# EAGLE design segment_display_2x_static (EAGLE 6.2)
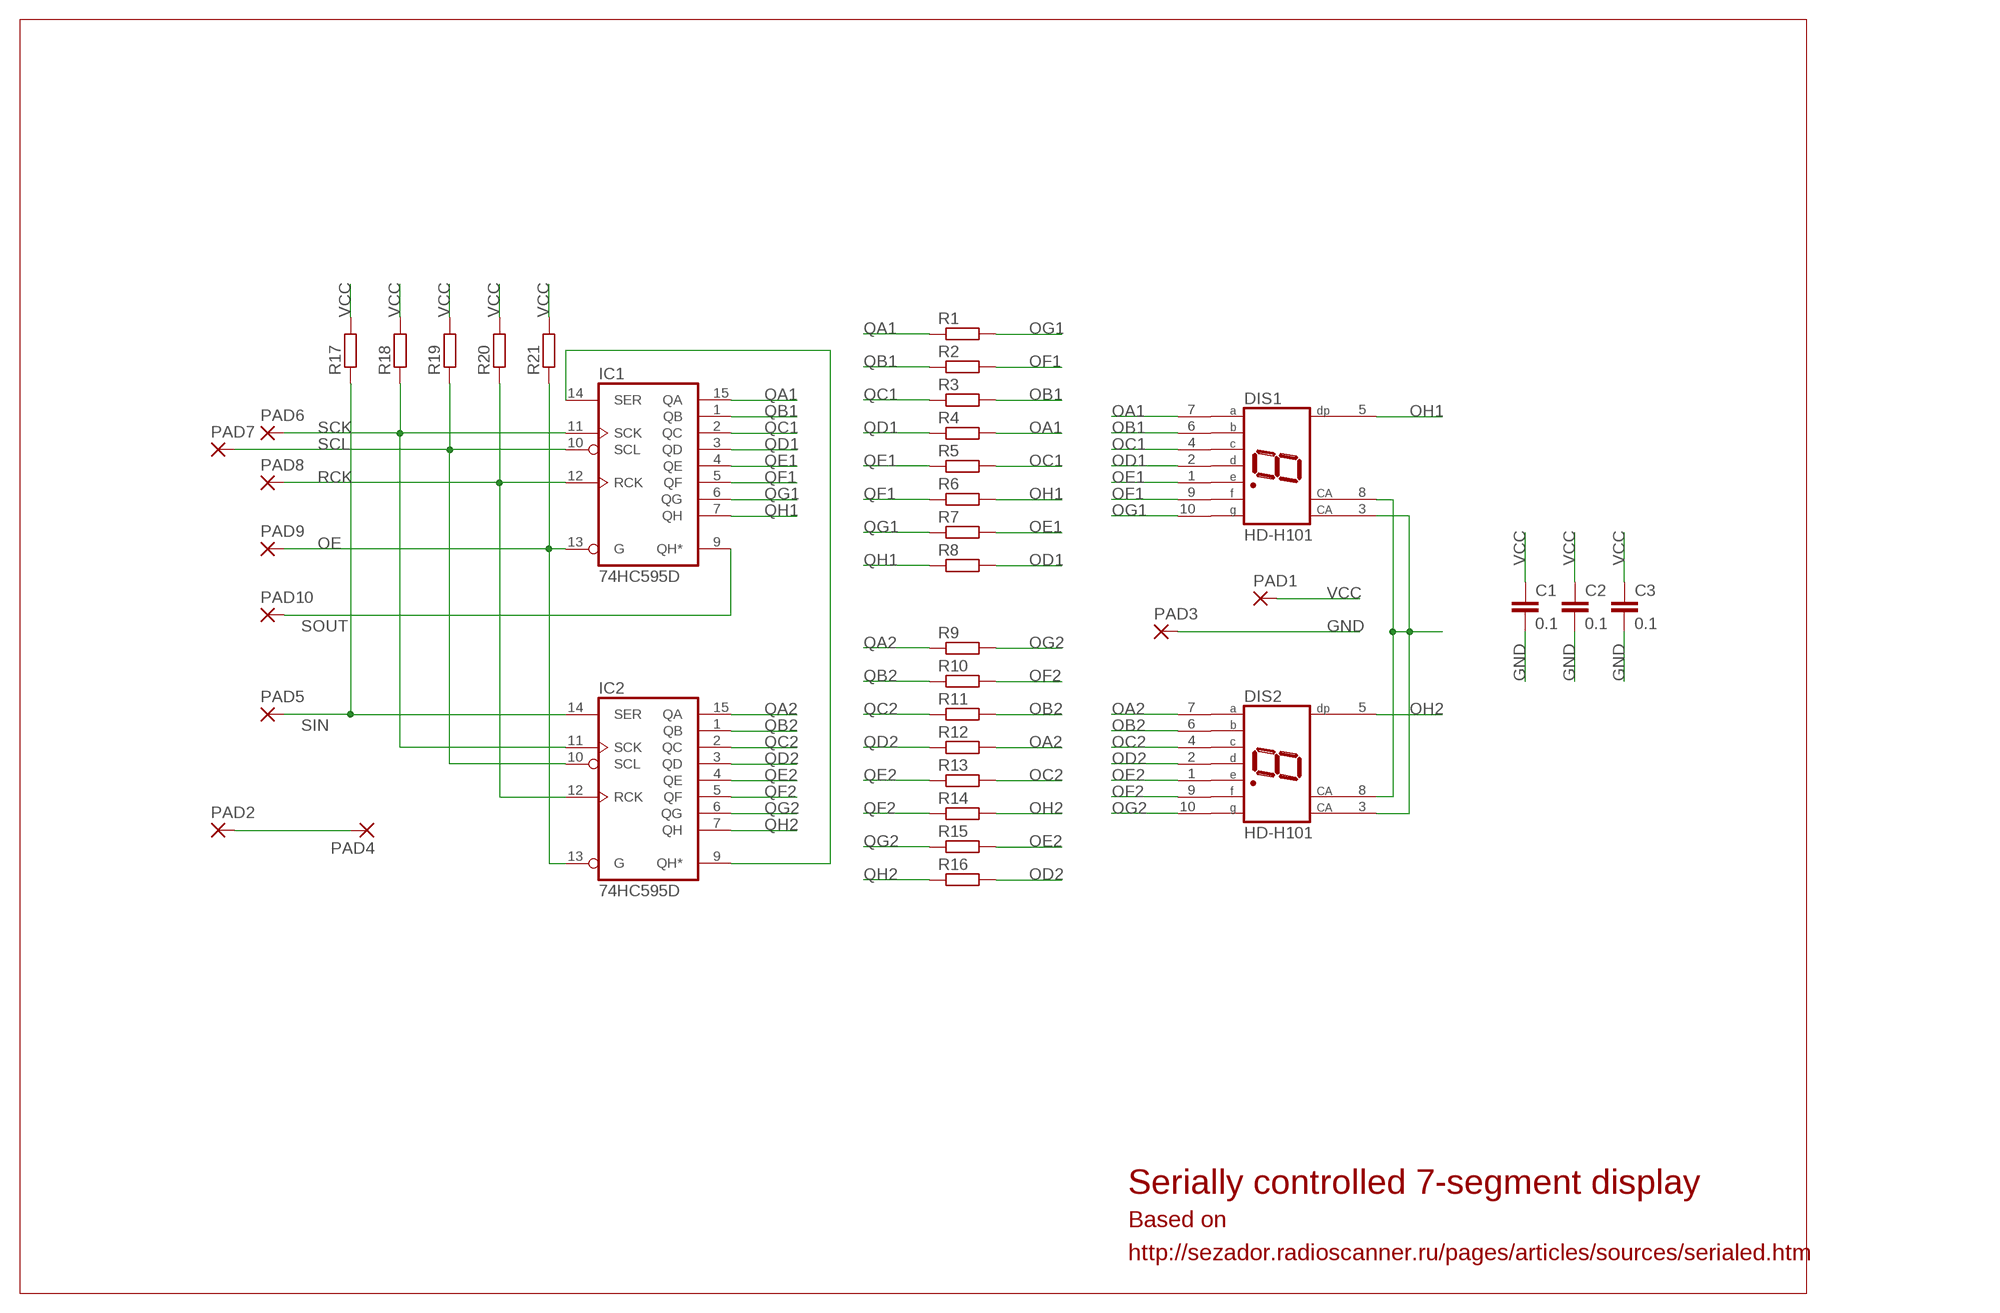
[diagram p0: schematic, sheet 1]

## Parts
C1  0.1  C-EUC0805  [C0805]
C2  0.1  C-EUC0805  [C0805]
C3  0.1  C-EUC0805  [C0805]
DIS1  HD-H101  [HDSP-M]
DIS2  HD-H101  [HDSP-M]
IC1  74HC595D  [SO16]
IC2  74HC595D  [SO16]
PAD1  1,6/0,8  [1,6/0,8]
PAD2  1,6/0,8  [1,6/0,8]
PAD3  1,6/0,8  [1,6/0,8]
PAD4  1,6/0,8  [1,6/0,8]
PAD5  1,6/0,8  [1,6/0,8]
PAD6  1,6/0,8  [1,6/0,8]
PAD7  1,6/0,8  [1,6/0,8]
PAD8  1,6/0,8  [1,6/0,8]
PAD9  1,6/0,8  [1,6/0,8]
PAD10  1,6/0,8  [1,6/0,8]
R1  R-EU_R0805  [R0805]
R2  R-EU_R0805  [R0805]
R3  R-EU_R0805  [R0805]
R4  R-EU_R0805  [R0805]
R5  R-EU_R0805  [R0805]
R6  R-EU_R0805  [R0805]
R7  R-EU_R0805  [R0805]
R8  R-EU_R0805  [R0805]
R9  R-EU_R0805  [R0805]
R10  R-EU_R0805  [R0805]
R11  R-EU_R0805  [R0805]
R12  R-EU_R0805  [R0805]
R13  R-EU_R0805  [R0805]
R14  R-EU_R0805  [R0805]
R15  R-EU_R0805  [R0805]
R16  R-EU_R0805  [R0805]
R17  R-EU_R0805  [R0805]
R18  R-EU_R0805  [R0805]
R19  R-EU_R0805  [R0805]
R20  R-EU_R0805  [R0805]
R21  R-EU_R0805  [R0805]

## Nets
GND: C1.2 C2.2 C3.2 PAD3.1(P)
LINK: IC1.14(SER) IC2.9(QH*)
OA1: DIS1.7(A) R4.2
OA2: DIS2.7(A) R12.2
OB1: DIS1.6(B) R3.2
OB2: DIS2.6(B) R11.2
OC1: DIS1.4(C) R5.2
OC2: DIS2.4(C) R13.2
OD1: DIS1.2(D) R8.2
OD2: DIS2.2(D) R16.2
OE: IC1.13(G) IC2.13(G) PAD9.1(P) R21.1
OE1: DIS1.1(E) R7.2
OE2: DIS2.1(E) R15.2
OF1: DIS1.9(F) R2.2
OF2: DIS2.9(F) R10.2
OG1: DIS1.10(G) R1.2
OG2: DIS2.10(G) R9.2
OH1: DIS1.5(DP) R6.2
OH2: DIS2.5(DP) R14.2
QA1: IC1.15(QA) R1.1
QA2: IC2.15(QA) R9.1
QB1: IC1.1(QB) R2.1
QB2: IC2.1(QB) R10.1
QC1: IC1.2(QC) R3.1
QC2: IC2.2(QC) R11.1
QD1: IC1.3(QD) R4.1
QD2: IC2.3(QD) R12.1
QE1: IC1.4(QE) R5.1
QE2: IC2.4(QE) R13.1
QF1: IC1.5(QF) R6.1
QF2: IC2.5(QF) R14.1
QG1: IC1.6(QG) R7.1
QG2: IC2.6(QG) R15.1
QH1: IC1.7(QH) R8.1
QH2: IC2.7(QH) R16.1
RCK: IC1.12(RCK) IC2.12(RCK) PAD8.1(P) R20.1
RET: PAD2.1(P) PAD4.1(P)
SCK: IC1.11(SCK) IC2.11(SCK) PAD6.1(P) R18.1
SCL: IC1.10(SCL) IC2.10(SCL) PAD7.1(P) R19.1
SIN: IC2.14(SER) PAD5.1(P) R17.1
SOUT: IC1.9(QH*) PAD10.1(P)
VCC: C1.1 C2.1 C3.1 DIS1.3(CA) DIS1.8(CA) DIS2.3(CA) DIS2.8(CA) PAD1.1(P) R17.2 R18.2 R19.2 R20.2 R21.2

## Notes on the sheet
- Serially controlled 7-segment display
- Based on
- http://sezador.radioscanner.ru/pages/articles/sources/serialed.htm

## Power pins joined to a net without a drawn wire
GND: IC1.8(GND) IC2.8(GND)
VCC: IC1.16(VCC) IC2.16(VCC)

## Library data of the parts
C1-C3 = rcl:C-EU: CAPACITOR, European symbol
DIS1 DIS2 = display-hp:HD-H101: LED DISPLAY 1-character 7 segment, decimal point right; OC_FARNELL: unknown; OC_NEWARK: unknown
IC1 IC2 = 74xx-eu:74*595: 8-bit SHIFT REGISTER, output latch
PAD1-PAD10 = wirepad:1,6/0,8: THROUGH-HOLE PAD
R1-R21 = rcl:R-EU_: RESISTOR, European symbol

## Board
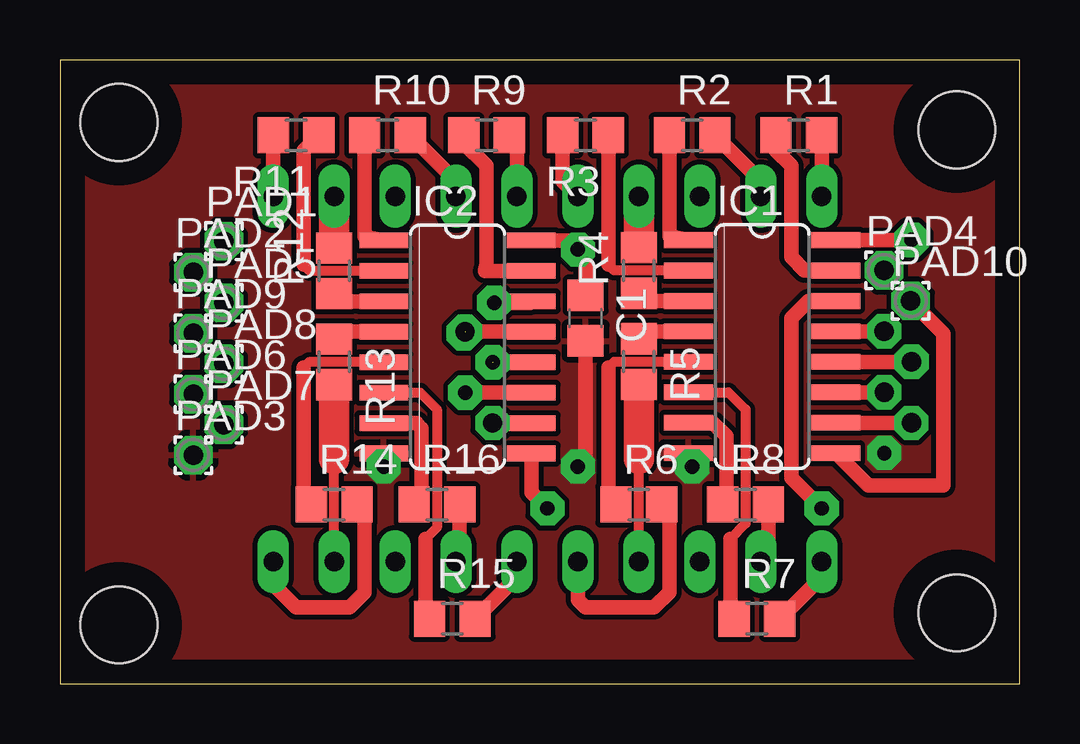
[diagram p1: board, top side]
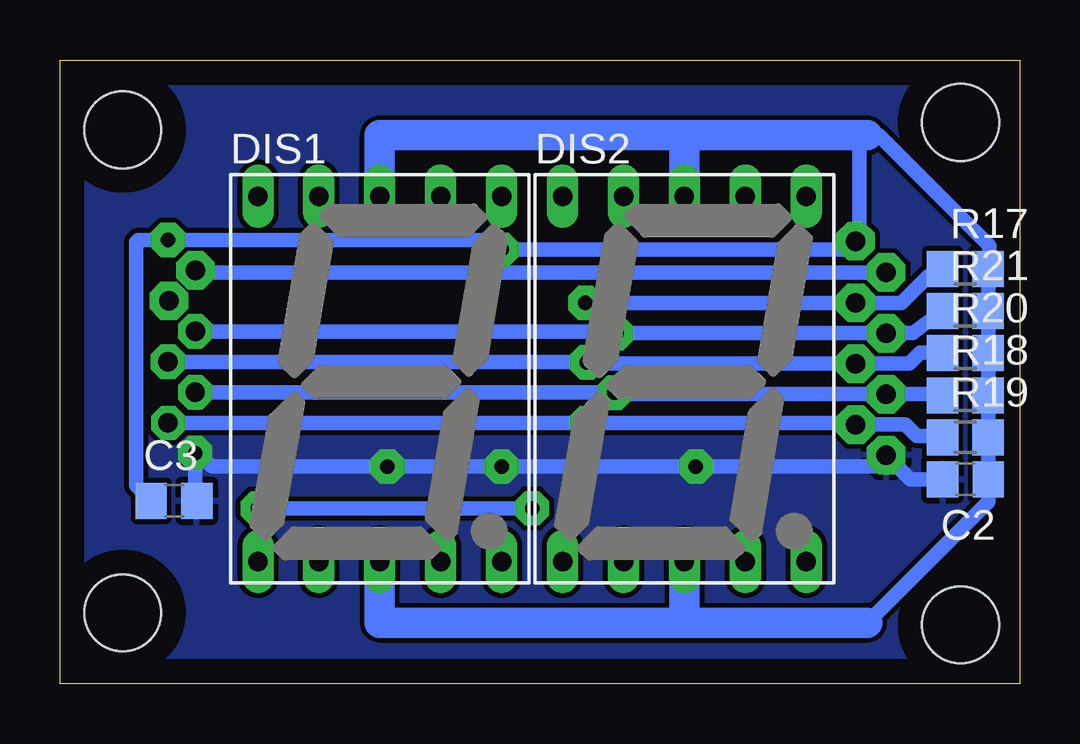
[diagram p2: board, bottom side, seen from below]

Size 40 x 26 mm. Coordinates in mm from the lower left corner, seen from the top.
Outline: 0,0 40,0 40,26 0,26 0,0
Copper layers (1*16): Top 0.035mm / dielectric 1.5mm / Bottom 0.035mm
Design rules: minimum track width 10mil, minimum drill 24mil, track to track 8mil, track to pad 8mil, pad to pad 8mil, via to via 8mil, smd to smd 8mil, copper to edge 40mil, drill to drill 8mil, minimum pad ring 10mil, minimum via ring 8mil, stop-mask expansion 4mil, vias tented up to drill 0mil, thermal gap 10mil
Holes 3.2 mm at 2.46,2.44 37.38,2.95 37.38,23.08 2.46,23.4

### Footprints (pad centres in the part's own frame; a part is rotated, then mirrored left to right if it is on the bottom)
C0805 = smd 1.3 x 1.5: 1 -0.95,0; 2 0.95,0
HDSP-M = drill 0.813 long: 1 -5.08,-7.62; 2 -2.54,-7.62; 3 0,-7.62; 4 2.54,-7.62; 5 5.08,-7.62; 6 5.08,7.62; 7 2.54,7.62; 8 0,7.62; 9 -2.54,7.62; 10 -5.08,7.62
SO16 = smd 0.66 x 2.032: 1 -4.445,-3.073; 2 -3.175,-3.073; 3 -1.905,-3.073; 4 -0.635,-3.073; 5 0.635,-3.073; 6 1.905,-3.073; 7 3.175,-3.073; 8 4.445,-3.073; 9 4.445,3.073; 10 3.175,3.073; 11 1.905,3.073; 12 0.635,3.073; 13 -0.635,3.073; 14 -1.905,3.073; 15 -3.175,3.073; 16 -4.445,3.073
1,6/0,8 = drill 0.813 pad 1.6 octagon: 1 0,0
R0805 = smd 1.3 x 1.5: 1 -0.95,0; 2 0.95,0

### Placement (x,y rotation side)
C1  21.91,15.24 270 top
C2  2.25,8.52 180 bottom
C3  35.24,7.62 0 bottom
DIS1  26.67,12.7 0 bottom
DIS2  13.97,12.7 0 bottom
IC1  29.27,14.05 270 top
IC2  16.57,14.03 270 top
PAD1  6.83,18.45 0 top
PAD2  5.56,17.14 0 top
PAD3  5.56,9.53 0 top
PAD4  34.35,17.23 0 top
PAD5  6.83,15.88 0 top
PAD6  5.56,12.06 0 top
PAD7  6.83,10.79 0 top
PAD8  6.83,13.34 0 top
PAD9  5.56,14.61 0 top
PAD10  35.46,15.96 0 top
R1  30.8,22.86 0 top
R2  26.35,22.86 0 top
R3  21.91,22.86 180 top
R4  24.13,17.22 90 top
R5  24.13,13.42 270 top
R6  24.13,7.46 0 top
R7  29.05,2.7 0 top
R8  28.57,7.46 0 top
R9  17.78,22.86 0 top
R10  13.65,22.86 0 top
R11  9.84,22.86 180 top
R12  11.43,17.21 90 top
R13  11.43,13.41 270 top
R14  11.43,7.46 0 top
R15  16.35,2.7 0 top
R16  15.72,7.46 0 top
R17  2.26,17.29 0 bottom
R18  2.26,12.01 0 bottom
R19  2.26,10.26 0 bottom
R20  2.26,13.77 0 bottom
R21  2.26,15.53 0 bottom

### Tracks (layer width: path | path; a pad name or v marks a point on that pad's centre or on a via)
GND  (via drill 0.6 pad 1.42)
  Top 0.61: IC2.8 v13.49,9.05 | v26.35,9.05 26.2,9.2 IC1.8 | C1.2 21.91,9.37 v21.59,9.05 | 34.21,9.61 v34.37,9.61
  Bottom 0.61: C2.2 4.55,8.52 PAD3.1 6.03,9.05 v13.49,9.05 v21.59,9.05 v26.35,9.05 33.66,9.05 v34.37,9.61 34.37,7.69 C3.2
  pour Bottom: 0,0 40,0 40,26 0,26
  pour Top: 0,0 40,0 40,26 0,26
LINK  (via drill 0.6 pad 1.42)
  Top 0.61: IC1.14 31.2,15.96 30.48,15.24 30.48,8.57 v31.75,7.3 | v20.32,7.3 19.65,7.98 IC2.9
  Bottom 0.61: v31.75,7.3 v20.32,7.3
OA1
  Top 1.27: R4.2 DIS1.7
OA2
  Top 1.27: R12.2 DIS2.7
OB1
  Top 0.61: R3.2 20.96,20.95 DIS1.6
OB2
  Top 0.61: DIS2.6 R11.2
OC1
  Top 0.406: DIS1.4 24.13,9.37
  Top 1.27: 24.13,9.37 R5.2
OC2
  Top 0.406: DIS2.4 11.43,9.37
  Top 1.27: 11.43,9.37 R13.2
OD1
  Top 0.61: R8.2 29.52,5.39 DIS1.2
OD2
  Top 0.61: R16.2 16.67,5.24 DIS2.2
OE  (via drill 0.6 pad 1.42, 0.8 pad 1.42)  (1 unrouted)
  Top 0.61: IC1.13 v34.36,14.69 | IC2.13 v16.89,14.67 v16.83,14.61
  Bottom 0.61: v34.36,14.69 16.91,14.69 v16.89,14.67 | v16.83,14.61 PAD9.1 4.45,14.61 R21.1 3.24,15.56
OE1
  Top 0.61: DIS1.1 31.75,4.45 R7.2
OE2
  Top 0.61: DIS2.1 19.05,4.45 R15.2
OF1
  Top 0.61: DIS1.9 29.21,20.95 R2.2
OF2
  Top 0.61: DIS2.9 16.51,20.95 R10.2
OG1
  Top 0.61: DIS1.10 R1.2
OG2
  Top 0.61: DIS2.10 19.05,22.54 R9.2
OH1
  Top 0.61: DIS1.5 21.59,3.49 21.91,3.17 24.77,3.17 25.4,3.81 25.4,7.14 R6.2
OH2
  Top 0.61: DIS2.5 8.89,4.13 9.84,3.17 12.06,3.17 12.7,3.81 12.7,7.14 R14.2
QA1
  Top 0.61: R1.1 29.85,22.22 30.48,21.59 30.48,17.78 31.04,17.23 IC1.15
QA2
  Top 0.61: R9.1 16.83,22.54 17.78,21.59 17.78,17.46 17.72,17.21 IC2.15
QB1
  Top 0.61: R2.1 25.4,18.65 IC1.1
QB2
  Top 0.61: R10.1 12.7,18.63 IC2.1
QC1
  Top 0.406: IC1.2 23.1,17.23 22.86,17.46
  Top 0.61: 22.86,17.46 R3.1
QC2
  Top 0.406: IC2.2 10.41,17.21 10.16,17.46
  Top 0.61: 10.16,17.46 10.16,22.22 R11.1
QD1
  Top 0.61: IC1.3 24.13,15.96 R4.1
QD2
  Top 0.61: IC2.3 11.43,15.94 R12.1
QE1
  Top 0.61: IC1.4 24.12,14.69 R5.1
QE2
  Top 0.61: IC2.4 11.37,14.67 R13.1
QF1
  Top 0.406: IC1.5 23.1,13.41 22.86,13.18 | 22.86,7.78 R6.1
  Top 0.61: 22.86,13.18 22.86,7.78
QF2
  Top 0.406: IC2.5 10.38,13.4 10.16,13.18 | 10.16,7.78 R14.1
  Top 0.61: 10.16,13.18 10.16,7.78
QG1
  Top 0.406: IC1.6 27.86,12.14 28.57,11.43 28.57,6.67 27.94,6.03
  Top 0.61: 27.94,6.03 27.94,2.86 R7.1
QG2
  Top 0.406: IC2.6 15.02,12.13 15.72,11.43 15.72,6.51 15.24,6.03
  Top 0.61: 15.24,6.03 15.24,2.86 R15.1
QH1
  Top 0.61: IC1.7 27.23,10.88 27.78,10.32 27.78,7.62 R8.1
QH2
  Top 0.61: IC2.7 14.86,10.86 15.08,10.64 15.08,7.78 R16.1
RCK  (via drill 0.6 pad 1.42, 0.8 pad 1.42)  (1 unrouted)
  Top 0.61: IC2.12 v18.04,13.4 | IC1.12 v35.5,13.41
  Bottom 0.61: v35.5,13.41 18.05,13.41 | v18.04,13.4 17.97,13.34 PAD8.1 4.6,13.34 4.13,13.81 3.25,13.81 R20.1
RET
  Bottom 0.61: PAD4.1 34.27,17.14 PAD2.1
SCK  (via drill 0.6 pad 1.42, 0.8 pad 1.42)
  Top 0.61: IC2.11 v16.89,12.13 | IC1.11 v34.36,12.14
  Bottom 0.61: v34.36,12.14 16.91,12.14 v16.89,12.13 16.83,12.06 PAD6.1 3.26,12.06 R18.1
SCL  (via drill 0.8 pad 1.42)
  Top 0.61: IC2.10 v18.03,10.86 | IC1.10 34.86,10.88 v35.5,10.87
  Bottom 0.61: v35.5,10.87 34.85,10.86 v18.03,10.86 6.89,10.86 PAD7.1 4.76,10.79 4.29,10.32 3.27,10.32 R19.1
SIN  (via drill 0.6 pad 1.42)
  Top 0.61: IC2.14 19.58,15.88 v18.1,15.88
  Bottom 0.61: v18.1,15.88 PAD5.1 4.92,15.88 3.81,16.99 3.52,16.99 R17.1 3.22,17.3
SOUT
  Top 0.61: IC1.9 33.7,8.26 36.83,8.26 36.83,14.59 PAD10.1
VCC  (via drill 0.6 pad 1.42)
  Top 0.61: C1.1 21.91,17.78 v21.59,18.1 21.21,18.48 IC2.16 | IC1.16 34.05,18.5 v35.5,18.5
  Bottom 0.61: 6.35,2.54 1.31,7.58 C2.1 | C2.1 R19.2 R18.2 R20.2 R21.2 R17.2 1.27,17.33 1.27,18.26 5.87,22.86 6.35,22.86 | 6.83,18.1 v21.59,18.1 21.99,18.5 v35.5,18.5 36.75,18.5 36.83,18.41 36.83,8.26 C3.1 | 6.67,22.86 6.67,18.1 6.83,18.1 | PAD1.1 6.83,18.42 6.83,18.1 | C2.1
  Bottom 1.27: DIS1.8 26.67,22.86 13.97,22.86 | 13.97,22.86 6.67,22.86 6.35,22.86 | DIS2.8 13.97,22.86 | DIS2.3 13.97,2.54 | 13.97,2.54 6.35,2.54 | DIS1.3 26.67,2.54 13.97,2.54